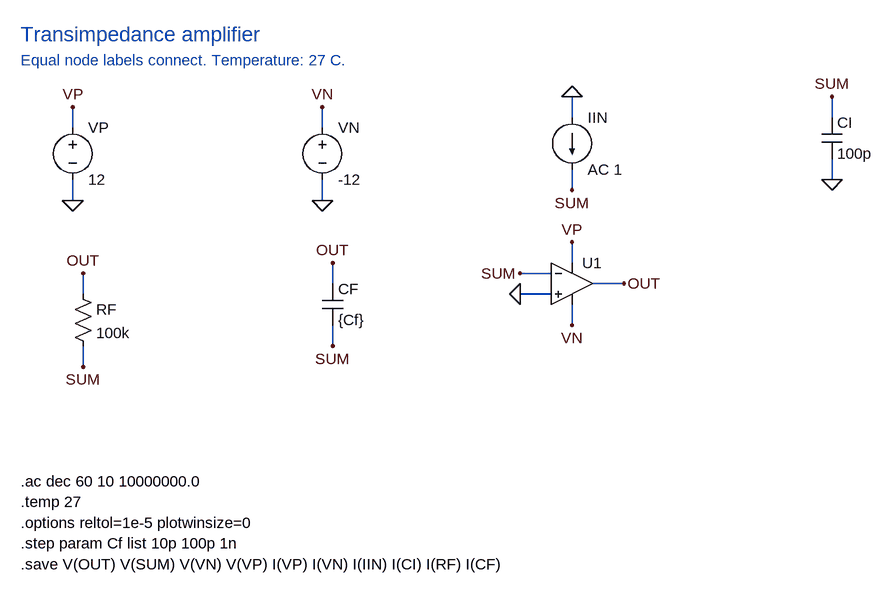
[diagram p0: schematic transimpedance-amplifier.asc]
transimpedance-amplifier.asc, the LTspice schematic file:
Version 4
SHEET 1 1740 1000
WIRE 144 176 144 144
WIRE 144 256 144 288
WIRE 528 176 528 144
WIRE 528 256 528 288
WIRE 912 160 912 128
WIRE 912 240 912 272
WIRE 1312 160 1312 128
WIRE 1312 224 1312 256
WIRE 160 432 160 400
WIRE 160 512 160 544
WIRE 544 416 544 384
WIRE 544 480 544 512
WIRE 880 432 832 432
WIRE 880 400 832 400
WIRE 912 384 912 352
WIRE 912 448 912 480
WIRE 944 416 992 416
FLAG 144 144 VP
FLAG 144 288 0
FLAG 528 144 VN
FLAG 528 288 0
FLAG 912 128 0
FLAG 912 272 SUM
FLAG 1312 128 SUM
FLAG 1312 256 0
FLAG 160 400 OUT
FLAG 160 544 SUM
FLAG 544 384 OUT
FLAG 544 512 SUM
FLAG 832 432 0
FLAG 832 400 SUM
FLAG 912 352 VP
FLAG 912 480 VN
FLAG 992 416 OUT
SYMBOL voltage 144 160 R0
SYMATTR InstName VP
SYMATTR Value 12
SYMBOL voltage 528 160 R0
SYMATTR InstName VN
SYMATTR Value -12
SYMBOL current 912 160 R0
SYMATTR InstName IIN
SYMATTR Value AC 1
SYMBOL cap 1296 160 R0
SYMATTR InstName CI
SYMATTR Value 100p
SYMBOL res 144 416 R0
SYMATTR InstName RF
SYMATTR Value 100k
SYMBOL cap 528 416 R0
SYMATTR InstName CF
SYMATTR Value {Cf}
SYMBOL OpAmps/UniversalOpamp2 912 416 R0
SYMATTR InstName U1
SYMATTR SpiceModel level2
SYMATTR Value2 Avol=1Meg GBW=10Meg Slew=10Meg
SYMATTR SpiceLine Ilimit=100m Rail=0.5 Vos=0
SYMATTR SpiceLine2 En=0 Enk=0 In=0 Ink=0 Rin=1G
TEXT 64 32 Left 3 ;Transimpedance amplifier
TEXT 64 72 Left 2 ;Equal node labels connect. Temperature: 27 C.
TEXT 64 720 Left 2 !.ac dec 60 10 10000000.0
TEXT 64 752 Left 2 !.temp 27
TEXT 64 784 Left 2 !.options reltol=1e-5 plotwinsize=0
TEXT 64 816 Left 2 !.step param Cf list 10p 100p 1n
TEXT 64 848 Left 2 !.save V(OUT) V(SUM) V(VN) V(VP) I(VP) I(VN) I(IIN) I(CI) I(RF) I(CF)

The netlist it stands for:
* transimpedance-amplifier.asc
VP VP 0 12
VN VN 0 -12
IIN 0 SUM AC 1
CI SUM 0 100p
RF OUT SUM 100k
CF OUT SUM {Cf}
XU1 0 SUM VP VN OUT level2 Avol=1Meg GBW=10Meg Slew=10Meg Ilimit=100m Rail=0.5 Vos=0 En=0 Enk=0 In=0 Ink=0 Rin=1G  ; pins In+ In- V+ V- OUT
* Transimpedance amplifier
* Equal node labels connect. Temperature: 27 C.
.ac dec 60 10 10000000.0
.temp 27
.options reltol=1e-5 plotwinsize=0
.step param Cf list 10p 100p 1n
.save V(OUT) V(SUM) V(VN) V(VP) I(VP) I(VN) I(IIN) I(CI) I(RF) I(CF)
.lib UniversalOpAmp2.lib
.backanno
.end